# Altium schematic sheet S7CAS-PLEIADES-CARTE-MERE_P20_Power-Tree-1.SchDoc
size Tabloid; SheetNumber: 3; SheetTotal: 20; Sheet_Name: Power Tree 1/3; Size: 11x17
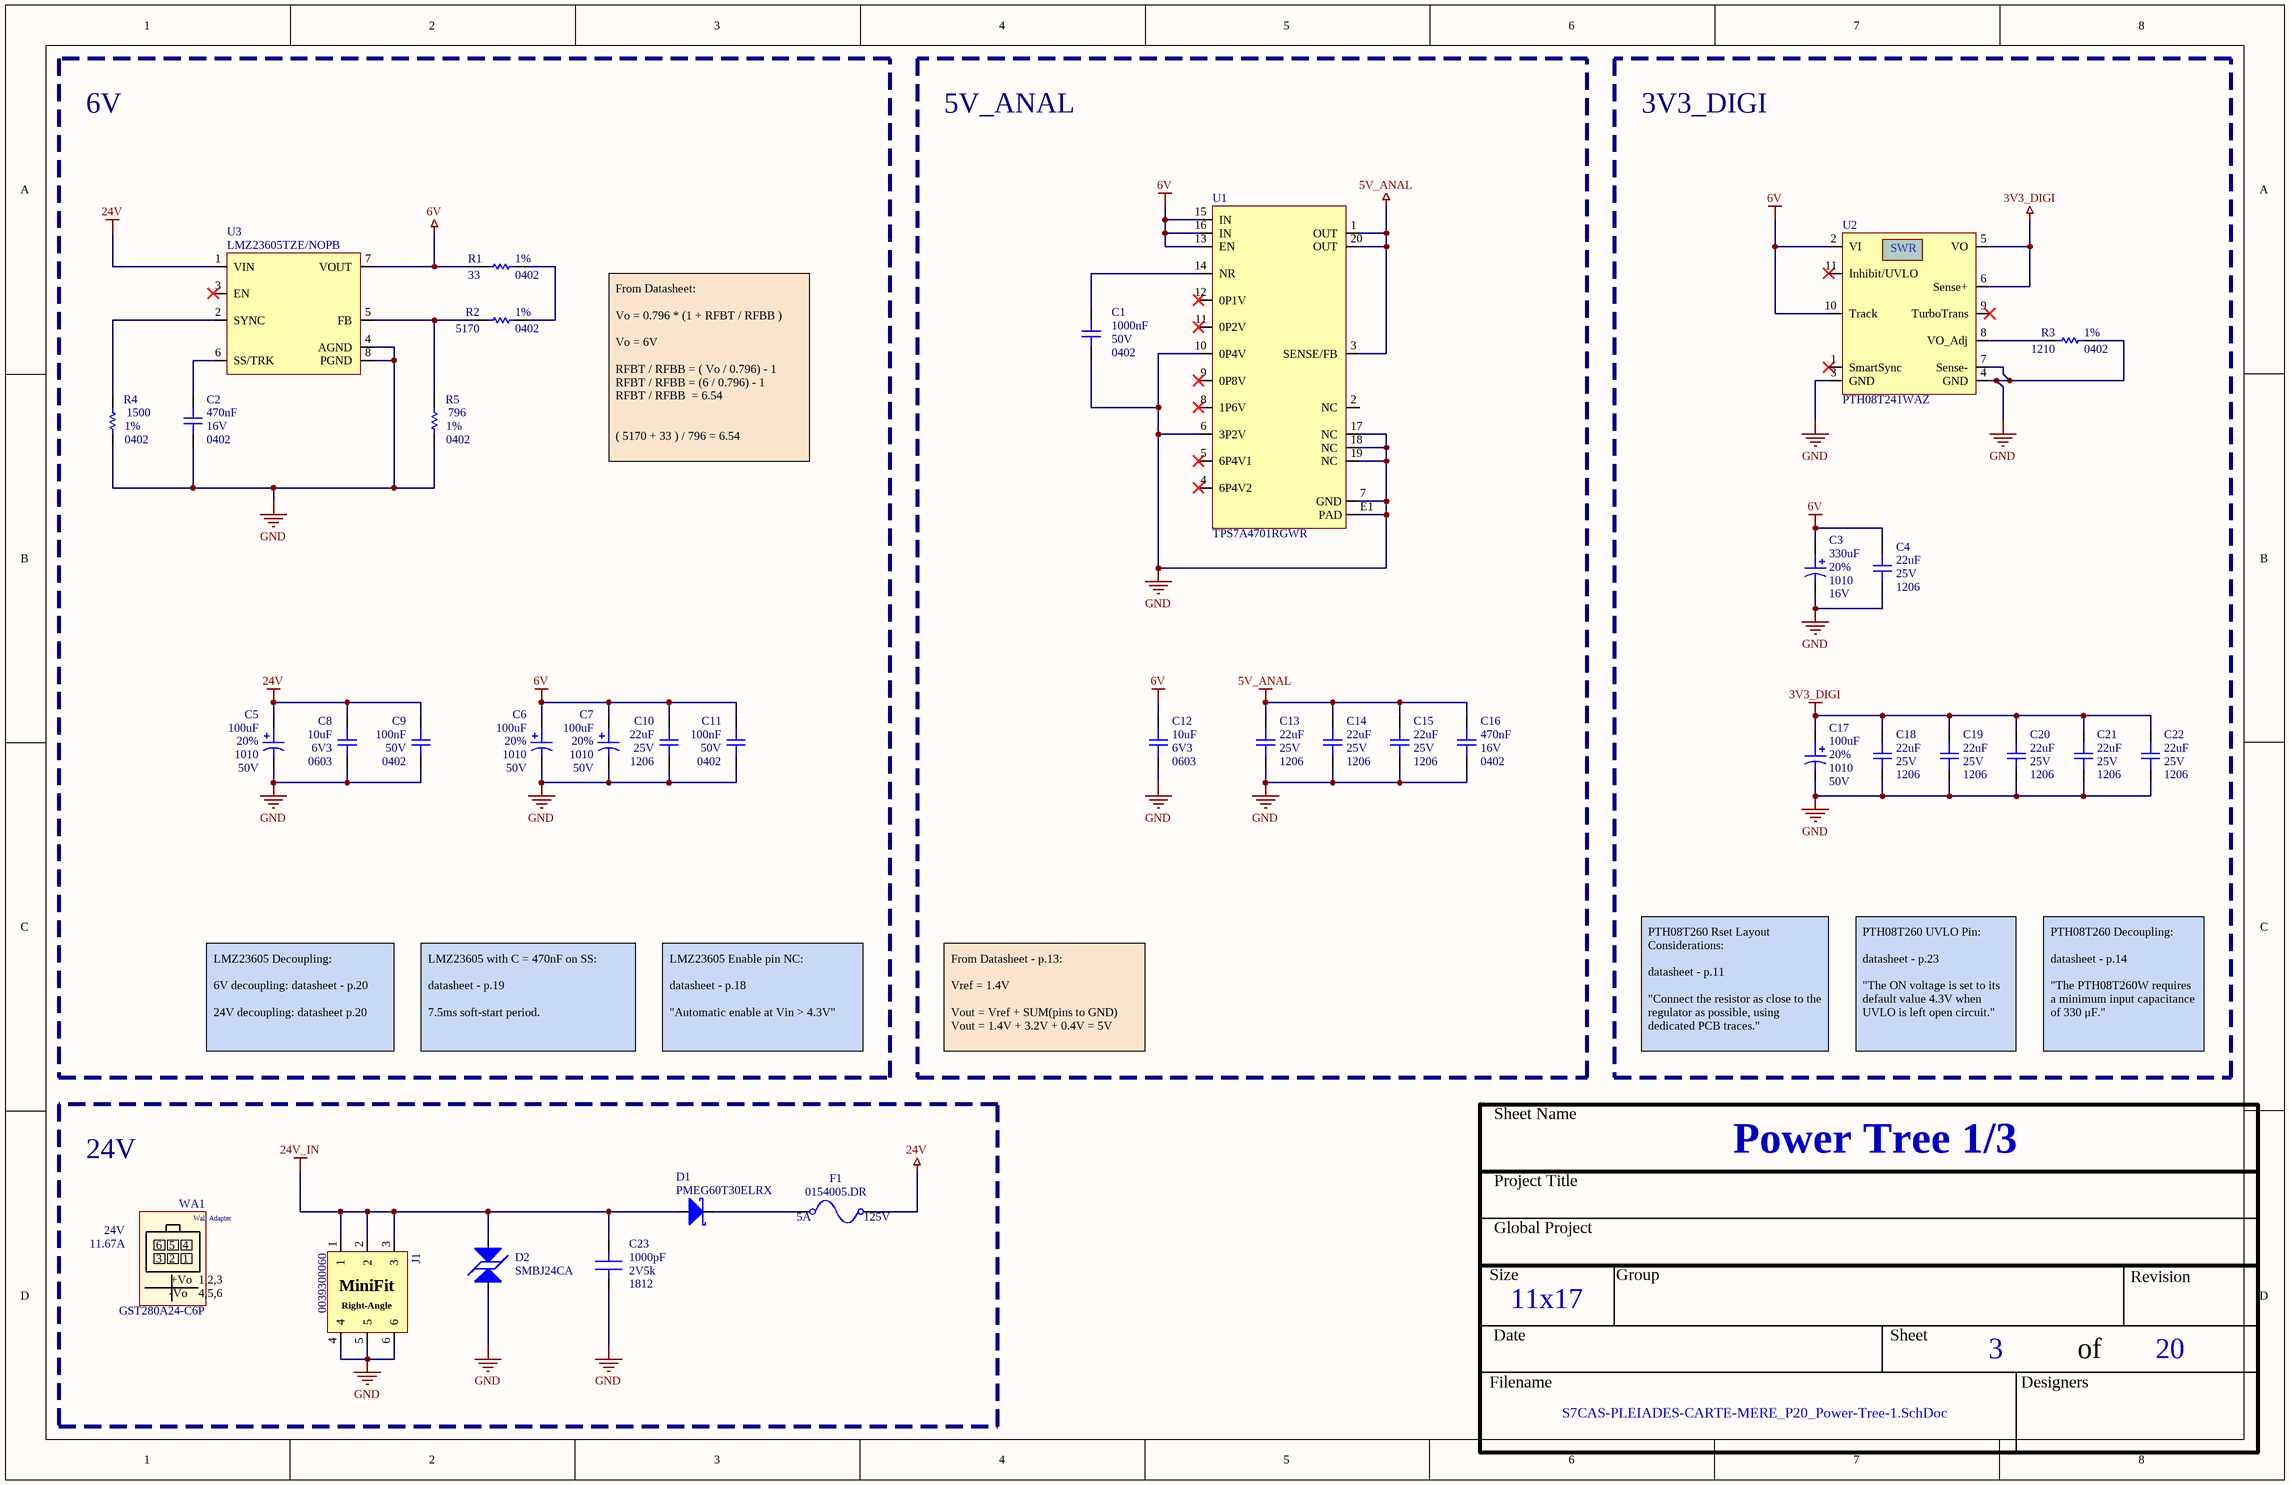
[diagram p0: S7CAS-PLEIADES-CARTE-MERE_P20_Power-Tree-1.SchDoc]

## Parts
C1  value 1000nF  Voltage: 50V  Package: 0402  [CAP_0402]  (hidden comment: CAP - 0402)
C2  value 470nF  Voltage: 16V  Package: 0402  [CAP_0402]  (hidden comment: CAP - 0402)
C3  value 330uF  Voltage: 16V  Package: 1010  Precision: 20%  [CAP_ALU_1010_vishay]  (hidden comment: MAL214699501E3)
C4  value 22uF  Voltage: 25V  Package: 1206  [CAP_1206]  (hidden comment: CAP - 1206)
C5  value 100uF  Voltage: 50V  Package: 1010  Precision: 20%  [CAP_ALU_1010_vishay]  (hidden comment: MAL215099101E3)
C6  value 100uF  Voltage: 50V  Package: 1010  Precision: 20%  [CAP_ALU_1010_vishay]  (hidden comment: MAL215099101E3)
C7  value 100uF  Voltage: 50V  Package: 1010  Precision: 20%  [CAP_ALU_1010_vishay]  (hidden comment: MAL215099101E3)
C8  value 10uF  Voltage: 6V3  Package: 0603  [CAP_0603]  (hidden comment: CAP - 0603)
C9  value 100nF  Voltage: 50V  Package: 0402  [CAP_0402]  (hidden comment: CAP - 0402)
C10  value 22uF  Voltage: 25V  Package: 1206  [CAP_1206]  (hidden comment: CAP - 1206)
C11  value 100nF  Voltage: 50V  Package: 0402  [CAP_0402]  (hidden comment: CAP - 0402)
C12  value 10uF  Voltage: 6V3  Package: 0603  [CAP_0603]  (hidden comment: CAP - 0603)
C13  value 22uF  Voltage: 25V  Package: 1206  [CAP_1206]  (hidden comment: CAP - 1206)
C14  value 22uF  Voltage: 25V  Package: 1206  [CAP_1206]  (hidden comment: CAP - 1206)
C15  value 22uF  Voltage: 25V  Package: 1206  [CAP_1206]  (hidden comment: CAP - 1206)
C16  value 470nF  Voltage: 16V  Package: 0402  [CAP_0402]  (hidden comment: CAP - 0402)
C17  value 100uF  Voltage: 50V  Package: 1010  Precision: 20%  [CAP_ALU_1010_vishay]  (hidden comment: MAL215099101E3)
C18  value 22uF  Voltage: 25V  Package: 1206  [CAP_1206]  (hidden comment: CAP - 1206)
C19  value 22uF  Voltage: 25V  Package: 1206  [CAP_1206]  (hidden comment: CAP - 1206)
C20  value 22uF  Voltage: 25V  Package: 1206  [CAP_1206]  (hidden comment: CAP - 1206)
C21  value 22uF  Voltage: 25V  Package: 1206  [CAP_1206]  (hidden comment: CAP - 1206)
C22  value 22uF  Voltage: 25V  Package: 1206  [CAP_1206]  (hidden comment: CAP - 1206)
C23  value 1000pF  Package: 1812  Voltage Rating: 2V5k  [CAP_CER_1812]  (hidden comment: 1812WC102KAT1A)
D1  PMEG60T30ELRX  [DIO_SCHOTTKY_PMEG60T30ELRX]
D2  SMBJ24CA  [TVS_PWR_SMBJ36CA]
F1  0154005.DR  Voltage Rating: 125V  Current Rating: 5A  [FUS_0154XXX.DR]
J1  0039300060  [CON_MINIFIT_0039300060]
R1  value 33  Package: 0402  Precision: 1%  [RES_0402]  (hidden comment: RES - 0402)
R2  value 5170  Package: 0402  Precision: 1%  [RES_0402]  (hidden comment: RES - 0402)
R3  value 1210  Package: 0402  Precision: 1%  [RES_0402]  (hidden comment: RES - 0402)
R4  value 1500  Package: 0402  Precision: 1%  [RES_0402]  (hidden comment: RES - 0402)
R5  value 796  Package: 0402  Precision: 1%  [RES_0402]  (hidden comment: RES - 0402)
U1  TPS7A4701RGWR  [REG_TPS7A4701RGWR]
U2  PTH08T241WAZ  [REG_SWR_PTH08T241WAZ]
U3  LMZ23605TZE/NOPB  [REG_SWR_LMZ23605TZE/NOPB]
WA1  GST280A24-C6P  value 24V  Current Rating: 11.67A  [Model Name]  (mechanical)

## Blocks framed on the sheet
6V: C2 C5-C11 R1 R2 R4 R5 U3
5V_ANAL: C1 C12-C16 U1
3V3_DIGI: C3 C4 C17-C22 R3 U2
24V: C23 D1 D2 F1 J1 WA1

## Nets
3V3_DIGI: C17.1 C18.2 C19.2 C20.2 C21.2 C22.2 U2.5(VO) U2.6(Sense+)
5V_ANAL: C13.2 C14.2 C15.2 C16.2 U1.1(OUT) U1.3(SENSE/FB) U1.20(OUT)
6V: C3.1 C4.2 C6.1 C7.1 C10.2 C11.2 C12.2 R1.2 U1.13(EN) U1.15(IN) U1.16(IN) U2.2(VI) U2.10(Track) U3.7(VOUT)
24V: C5.1 C8.2 C9.2 F1.2 U3.1(VIN)
24V_IN: C23.1 D1.A D2.1 J1.1 J1.2 J1.3
GND: C1.2 C2.1 C3.2 C4.1 C5.2 C6.2 C7.2 C8.1 C9.1 C10.1 C11.1 C12.1 C13.1 C14.1 C15.1 C16.1 C17.2 C18.1 C19.1 C20.1 C21.1 C22.1 C23.2 D2.2 J1.4 J1.5 J1.6 R3.1 R4.1 R5.1 U1.6(3P2V) U1.7(GND) U1.10(0P4V) U1.17(NC) U1.18(NC) U1.19(NC) U1.E1(PAD) U2.3(GND) U2.4(GND) U2.7(Sense-) U3.4(AGND) U3.8(PGND)
NetC1_1: C1.1 U1.14(NR)
NetC2_2: C2.2 U3.6(SS/TRK)
NetD1_K: D1.K F1.1
NetR1_1: R1.1 R2.1
NetR2_2: R2.2 R5.2 U3.5(FB)
NetR3_2: R3.2 U2.8(VO_Adj)
NetR4_2: R4.2 U3.2(SYNC)

Not connected (* = marked no-connect by the designer): U1 2(NC) 4(6P4V2)* 5(6P4V1)* 8(1P6V)* 9(0P8V)* 11(0P2V)* 12(0P1V)*; U2 1(SmartSync)* 9(TurboTrans)* 11(Inhibit/UVLO)*; U3 3(EN)*

## Notes on the sheet
- From Datasheet:
  Vo = 0.796 * (1 + RFBT / RFBB )
  Vo = 6V
  RFBT / RFBB = ( Vo / 0.796) - 1
  RFBT / RFBB = (6 / 0.796) - 1
  RFBT / RFBB  = 6.54
  ( 5170 + 33 ) / 796 = 6.54
- LMZ23605 Decoupling:
  6V decoupling: datasheet - p.20
  24V decoupling: datasheet p.20
- LMZ23605 with C = 470nF on SS:
  datasheet - p.19
  7.5ms soft-start period.
- LMZ23605 Enable pin NC:
  datasheet - p.18
  "Automatic enable at Vin > 4.3V"
- From Datasheet - p.13:
  Vref = 1.4V
  Vout = Vref + SUM(pins to GND)
  Vout = 1.4V + 3.2V + 0.4V = 5V
- PTH08T260 Rset Layout Considerations:
  datasheet - p.11
  "Connect the resistor as close to the regulator as possible, using dedicated PCB traces."
- PTH08T260 UVLO Pin:
  datasheet - p.23
  "The ON voltage is set to its default value 4.3V when UVLO is left open circuit."
- PTH08T260 Decoupling:
  datasheet - p.14
  "The PTH08T260W requires a minimum input capacitance of 330 μF."
- Sheet Name
- Project Title
- Global Project
- Size
- Group
- Revision
- Date
- Sheet
- of
- Filename
- Designers
- (in symbol CON_MINIFIT_0039300060) MiniFit; Right-Angle
- (in symbol REG_SWR_PTH08T241WAZ) SWR
- (in symbol UND_GST280A24-C6P) Wall Adapter; 6; 5; 4; 3; 2; 1; +Vo; 1,2,3; -Vo; 4,5,6

## Library data of the parts
C1 = CAP - 0402: Mfg Part Number: GXT155R61E105KE01; Precision: 10%; Current: *; CreatedBy: Jonathan Bouchard; Power: *
C2 C16 = CAP - 0402: Mfg Part Number: GXT155R61C474KE01; Precision: 10%; Current: *; CreatedBy: Jonathan Bouchard; Power: *
C3 = CAP_ALU_MAL214699501E3: CAP - ALU 330uF 20% 16V - 1010; Current: 750mA; Mfg: Vishay Dale; Mfg Part Number: MAL214699501E3; HelpURL: http://www.vishay.com/docs/28403/146cti.pdf; CreatedBy: Jonathan Bouchard; Temperature: -55°C to 125°C; Power: *; Supplier 1: Digikey; Supplier Part Number 1: 4405PHCT-ND
C4 C10 C13-C15 C18-C22 = CAP - 1206: Mfg Part Number: GRM31CC81E226KE11; Precision: 10%; Current: *; HelpURL: https://search.murata.co.jp/Ceramy/image/img/A01X/G101/ENG/GRM31CD71H106KE11-01A.pdf; CreatedBy: Jonathan Bouchard; Power: *
C5-C7 C17 = CAP_ALU_MAL215099101E3: CAP - ALU 100uF 20% 50V - 1010; Current: 490mA; Mfg: Vishay Dale; Mfg Part Number: MAL215099101E3; HelpURL: http://www.vishay.com/docs/28395/150crz.pdf; CreatedBy: Jonathan Bouchard; Temperature: -55°C to 125°C; Power: *; Supplier 1: Digikey; Supplier Part Number 1: 4399PHDKR-ND
C8 C12 = CAP - 0603: Mfg Part Number: GRM185R60J106ME15; Precision: 20%; Current: *; CreatedBy: Jonathan Bouchard; Power: *
C9 C11 = CAP - 0402: Mfg Part Number: GRM155R61H104KE14; Precision: 10%; Current: *; CreatedBy: Jonathan Bouchard; Power: *
C23 = CAP_CER_1812WC102KAT1A: CAP - CER 1000PF 2.5KV X7R - 1812; Tolerance: 10%; GRAMS Lib Spec: 2.7; Temperature: -55 to 125C
D1 = DIO_SCHOTTKY_PMEG60T30ELRX: DIO -  SCHOTTKY 60V 3A - SOD-123W; Manufacturer #1: Nexperia USA Inc.; GRAMS Lib Spec: 2.8c; Magnetic Material: UNKNOWN; Polarized: YES; Value: 620mV @ 3A; Assembly Type: SMD; CreatedBy/Date: Jonathan Bouchard 2020-03-23; Current Rating: 3A; HelpURL: https://assets.nexperia.com/documents/data-sheet/PMEG60T30ELR.pdf; Manufacturer #2: *; Note: *; Package: SOD-123W; Part Number #1: PMEG60T30ELRX; Part Number #2: *; Power Max: *; Supplier 1: Digi-Key; Supplier Part Number 1: 1727-7806-1-ND; Temperature: 175°C (Max); Tolerance: *; VerifiedBy: C.Paulin - 22/04/2020; Voltage Rating: 60V; Cryo: UNKNOWN; Mfg Part Number: PMEG60T30ELRX
D2 = TVS_PWR_SMBJ24CA: TVS - 24V 26.7V 600W - DO214AA; Manufacturer #1: Littelfuse Inc.; Value: Vbr = 26.7V -  Clamp = 38.9V; Voltage Rating: 24V Standoff; Current Rating: 15.5A; GRAMS Lib Spec: 2.8; Magnetic Material: UNKNOWN; Polarized: NO; Tolerance: *; Power Max: 600W; HelpURL: http://www.littelfuse.com/~/media/electronics/datasheets/tvs_diodes/littelfuse_tvs_diode_smbj_datasheet.pdf.pdf; CreatedBy/Date: Arnaud Samson - 06/07/18; VerifiedBy: Jonathan Bouchard - 2018-07-13; Temperature: -65°C ~ 150°C (TJ); Package: DO214AA; Manufacturer #2: *; Note: *; Assembly Type: SMD; Part Number #2: *; Part Number #1: SMBJ24CA; Supplier 1: Digi-Key; Supplier Part Number 1: SMBJ24CALFCT-ND; Cryo: UNKNOWN; Mfg Part Number: SMBJ24CA
F1 = FUS_0154005.DR: FUS - 5 A 125 VAC/VDC - 2-SMD; Manufacturer #1: Littelfuse Inc.; Value: 5A 125V AC/DC FAST; GRAMS Lib Spec: 2.8; Magnetic Material: UNKNOWN; Polarized: NO; Tolerance: *; Power Max: *; HelpURL: http://www.littelfuse.com/~/media/electronics/datasheets/fuses/littelfuse_fuse_154_154t_154l_154tl_datasheet.pdf.pdf; CreatedBy/Date: Arnaud Samson - 06/07/18; VerifiedBy: Jonathan Bouchard 2018-07-16; Temperature: -55°C ~ 125°C; Package: 2-SMD; Manufacturer #2: *; Note: *; Assembly Type: SMD; Part Number #2: *; Part Number #1: 0154005.DR; Supplier 1: Digi-Key; Supplier Part Number 1: F1228CT-ND; Cryo: UNKNOWN
J1 = CON_MINIFIT_0039300060: CON - Mini-Fit Through Hole, Right Angle 6 position; Manufacturer #1: Molex; Current Rating: 8A; GRAMS Lib Spec: 2.8; Magnetic Material: Unknown; Polarized: Yes; Voltage Rating: 600V; Assembly Type: TH; CreatedBy/Date: Joel Lemay 2018-06-21; HelpURL: https://www.molex.com/pdm_docs/sd/039300060_sd.pdf; Manufacturer #2: *; Package: TH; Part Number #1: 0039300060; Part Number #2: *; Power Max: *; Supplier 1: Digi-Key; Supplier Part Number 1: WM21353-ND; Temperature: - 40°C to + 80°C; Tolerance: *; Value: *; VerifiedBy: Caroline Paulin - 10 sept 2018; Cryo: UNKNOWN
R1 = RES - 0402: Mfg Part Number: CRCW040233R0FKEDC; Voltage: 50V; Power: 1/16W; Current: *; CreatedBy: Jonathan Bouchard
R2 = RES - 0402: Mfg Part Number: RN73H1ETTP5171F50; Voltage: 50V; Power: 1/16W; Current: *; CreatedBy: Jonathan Bouchard
R3 = RES - 0402: Mfg Part Number: CRCW04021K21FKEDC; Voltage: 50V; Power: 1/16W; Current: *; CreatedBy: Jonathan Bouchard
R4 = RES - 0402: Voltage: 50V; Power: 1/16W; Current: *; CreatedBy: Jonathan Bouchard
R5 = RES - 0402: Mfg Part Number: RN73H1ETTP7960F50; Voltage: 50V; Power: 1/16W; Current: *; CreatedBy: Jonathan Bouchard
U1 = REG_LDO_TPS7A4701RGWR: REG - LINEAR POS ADJ 1A - 20VQFN; Manufacturer #1: Texas Instruments; GRAMS Lib Spec: 2.8; Magnetic Material: Unknown; Polarized: Yes; Value: 1.4 à 34V; Voltage rating: 35V max; Assembly Type: SMD; CreatedBy/Date: L-P Gauthier / 2018-05-29; Current Rating: 1A; Manufacturer #2: TBD; Part Number #1: TPS7A4701RGWR; Part Number #2: TBD; Package: 20-VQFN Exposed Pad; Power Max: *; Tolerance: -; Supplier 1: Digi-Key; Supplier Part Number 1: 296-37224-1-ND; VerifiedBy: Caroline Paulin - 28 sept 2018; Temperature: -40°C ~ 125°C; HelpURL: http://www.ti.com/lit/ds/symlink/tps7a47.pdf; Cryo: UNKNOWN; Mfg Part Number: TPS7A4701RGWR
U2 = REG_SWR_PTH08T241WAZ: REG - MODULE PIP 10A 14VIN - 11-SMD; Manufacturer #1: Texas Instruments; Current Rating: 10A (out); Voltage rating: 4.5-14V (Input), 0.69 - 5.5V (Out); Polarized: Yes; Magnetic Material: UNKNOWN; Manufacturer #2: *; Note: *; Power Max: *; Value: *; Part Number #1: PTH08T241WAZ; Part Number #2: *; HelpURL: http://www.ti.com/lit/ds/symlink/pth08t241w.pdf; Supplier 1: Digi-Key; Supplier Part Number 1: 296-21339-ND; Assembly Type: SMD; Temperature: -40°C ~ 85°C; Package: SMD; CreatedBy/Date: Olivier Bernard / 6/5/2018; VerifiedBy: Caroline Paulin / 10 juillet 2018; Cryo: UNKNOWN; Mfg Part Number: PTH08T241WAZ
U3 = REG_SWR_LMZ23605TZE/NOPB: REG - IC BUCK SYNC 36V 5A - TO-PMOD-7; Manufacturer #1: Texas Instruments; Value: 0.8 ~ 6 V; Voltage Rating: 6 ~ 36 V; GRAMS Lib Spec: 2.8; Note: One Reflow; Magnetic Material: YES; Cryo: UNKNOWN; Tolerance: *; Current Rating: 5A; Power Max: *; HelpURL: http://www.ti.com/lit/ds/symlink/lmz23605.pdf; CreatedBy/Date: Arnaud Samson - 05/07/18; VerifiedBy: Jonathan Bouchard 2018-07-13; Temperature: -40°C ~ 125°C; Package: TO-PMOD-7; Manufacturer #2: *; Assembly Type: SMD; Part Number #2: *; Part Number #1: LMZ23605TZE/NOPB; Polarized: YES; Supplier 1: Digi-Key; Supplier Part Number 1: 296-35357-1-ND; Mfg Part Number: LMZ23605TZE/NOPB
WA1 = UND_GST280A24-C6P: UND - AC/DC DESKTOP ADAPTER 24V 280W - MEC; Manufacturer #1: MEAN WELL USA Inc.; Tolerance: ±3%; Voltage Rating: 85~264VAC; GRAMS Lib Spec: 2.8; Magnetic Material: Unknown; Polarized: Yes; Power Max: 280W; HelpURL: https://www.meanwell.com/Upload/PDF/GST280A/GST280A-SPEC.PDF; CreatedBy/Date: Caroline Paulin - 5 avril 2019; VerifiedBy: Nicolas V. (2019-07-05); Temperature: -30°C to +70°C; Package: -; Manufacturer #2: *; Note: *; Assembly Type: -; Part Number #2: *; Part Number #1: GST280A24-C6P; Supplier 1: Digi-Key; Supplier Part Number 1: 1866-2122-ND; Cryo: UNKNOWN; Mfg Part Number: GST280A24-C6P